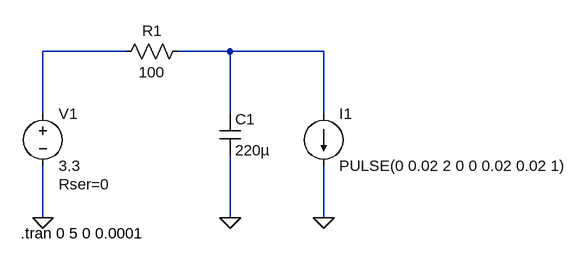
[diagram p0: schematic DropOutExample.asc]
DropOutExample.asc, the LTspice schematic file:
Version 4
SHEET 1 984 680
WIRE 208 -64 80 -64
WIRE 368 -64 288 -64
WIRE 512 -64 368 -64
WIRE 80 32 80 -64
WIRE 368 32 368 -64
WIRE 512 32 512 -64
WIRE 80 192 80 112
WIRE 368 192 368 96
WIRE 512 192 512 112
FLAG 80 192 0
FLAG 368 192 0
FLAG 512 192 0
SYMBOL voltage 80 16 R0
WINDOW 123 0 0 Left 0
WINDOW 39 24 124 Left 2
SYMATTR InstName V1
SYMATTR Value 3.3
SYMATTR SpiceLine Rser=0
SYMBOL res 304 -80 R90
WINDOW 0 0 56 VBottom 2
WINDOW 3 32 56 VTop 2
SYMATTR InstName R1
SYMATTR Value 100
SYMBOL cap 352 32 R0
SYMATTR InstName C1
SYMATTR Value 220µ
SYMATTR SpiceLine Rser=0
SYMBOL current 512 32 R0
WINDOW 123 0 0 Left 0
WINDOW 39 0 0 Left 0
SYMATTR InstName I1
SYMATTR Value PULSE(0 0.02 2 0 0 0.02 0.02 1)
TEXT 46 216 Left 2 !.tran 0 5 0 0.0001

The netlist it stands for:
* DropOutExample.asc
V1 N001 0 3.3 Rser=0
R1 N002 N001 100
C1 N002 0 220µ Rser=0
I1 N002 0 PULSE(0 0.02 2 0 0 0.02 0.02 1)
.tran 0 5 0 0.0001
.backanno
.end